# Altium project watch_V2.1.PrjPcb
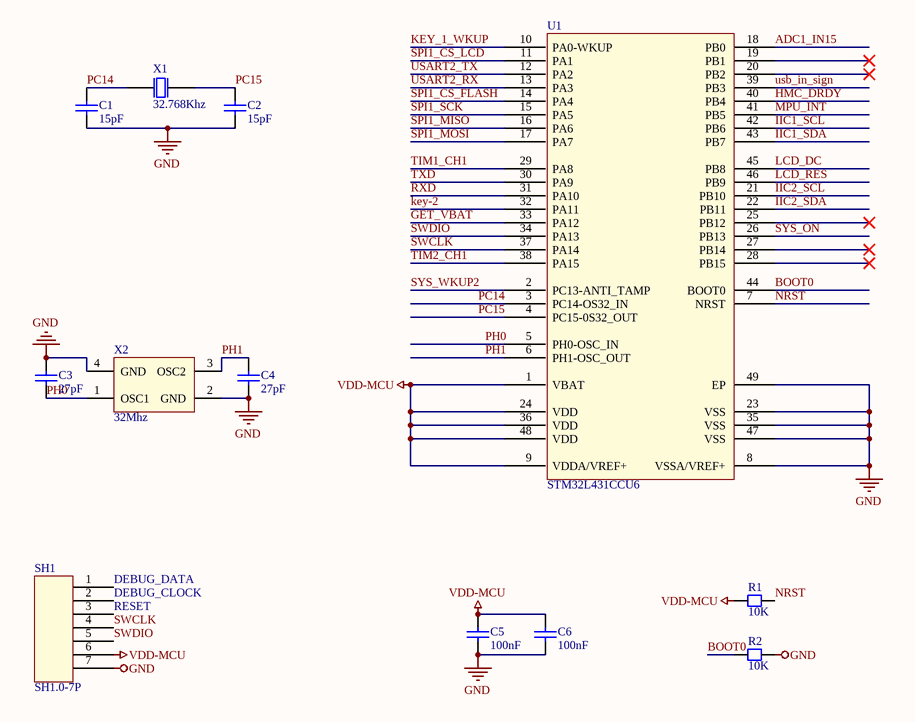
[diagram p0: 01-MCU-V2.1.SchDoc]
4 sheets, 97 parts. Net scope: global (net labels, ports and power ports of the same name join across sheets).
Board file: PCB-watch-V2.1.PcbDoc
Sheets:
  01-MCU-V2.1.SchDoc
  02-bluetooth-V2.1.SchDoc
  03-PeripheralPart-V2.1.SchDoc
  04-POWERV2.1.SchDoc

## Sheet 01-MCU-V2.1.SchDoc
size A4; Organization: Protel International P/L; Address1: L3, 12a Rodborough Rd; Address2: Frenchs Forest; Address3: NSW; Address4: Australia 2086

### Parts
C1  15pF  [CC1005-0402]
C2  15pF  [CC1005-0402]
C3  27pF  [CC1005-0402]
C4  27pF  [CC1005-0402]
C5  100nF  [CC1005-0402]
C6  100nF  [CC1005-0402]
R1  10K  [CR1005-0402]
R2  10K  [CR1005-0402]
SH1  SH1.0-7P  [SH1.0-6P]
U1  STM32L431CCU6  [STM32-UFQFPN48_N]
X1  32.768Khz  [XTAL-2012]
X2  32Mhz  [XTAL-2016]

### Nets
GND: C1.1 C2.1 C3.2 C4.1 C5.1 C6.1 R2.1 SH1.7 U1.8(VSSA/VREF+) U1.23(VSS) U1.35(VSS) U1.47(VSS) U1.49(EP) X2.2(GND) X2.4(GND)
VDD-MCU: C5.2 C6.2 R1.2 SH1.6 U1.1(VBAT) U1.9(VDDA/VREF+) U1.24(VDD) U1.36(VDD) U1.48(VDD)
ADC1_IN15: U1.18(PB0)
BOOT0: R2.2 U1.44(BOOT0)
DEBUG_CLOCK: SH1.2
DEBUG_DATA: SH1.1
GET_VBAT: U1.33(PA12)
HMC_DRDY: U1.40(PB4)
IIC1_SCL: U1.42(PB6)
IIC1_SDA: U1.43(PB7)
IIC2_SCL: U1.21(PB10)
IIC2_SDA: U1.22(PB11)
key-2: U1.32(PA11)
KEY_1_WKUP: U1.10(PA0-WKUP)
LCD_DC: U1.45(PB8)
LCD_RES: U1.46(PB9)
MPU_INT: U1.41(PB5)
NRST: R1.1 U1.7(NRST)
PC14: C1.2 U1.3(PC14-OS32_IN) X1.2
PC15: C2.2 U1.4(PC15-0S32_OUT) X1.1
PH0: C3.1 U1.5(PH0-OSC_IN) X2.1(OSC1)
PH1: C4.2 U1.6(PH1-OSC_OUT) X2.3(OSC2)
RESET: SH1.3
RXD: U1.31(PA10)
SPI1_CS_FLASH: U1.14(PA4)
SPI1_CS_LCD: U1.11(PA1)
SPI1_MISO: U1.16(PA6)
SPI1_MOSI: U1.17(PA7)
SPI1_SCK: U1.15(PA5)
SWCLK: SH1.4 U1.37(PA14)
SWDIO: SH1.5 U1.34(PA13)
SYS_ON: U1.26(PB13)
SYS_WKUP2: U1.2(PC13-ANTI_TAMP)
TIM1_CH1: U1.29(PA8)
TIM2_CH1: U1.38(PA15)
TXD: U1.30(PA9)
USART2_RX: U1.13(PA3)
USART2_TX: U1.12(PA2)
usb_in_sign: U1.39(PB3)

Not connected (* = marked no-connect by the designer): U1 19(PB1)* 20(PB2)* 25(PB12)* 27(PB14)* 28(PB15)*

### Notes on the sheet
- Title
- Size:
- Date:
- A4
- Number:
- Time:
- Revision:
- Sheet
- of
- File:

### Library data of the parts
C1-C6 = Chip capacitor: 贴片电容
R1 R2 = Chip resistor: 贴片电阻
SH1 = SH1.0-7P: 间距为1mm的端子
U1 = STM32L431CCU6: stm32低功耗单片机 主频80MHz
X1 = XTAL 2012: 2012封装的时钟晶振
X2 = XTAL 2016: 2016封装的晶振

## Sheet 02-bluetooth-V2.1.SchDoc
size A4; Organization: Protel International P/L; Address1: L3, 12a Rodborough Rd; Address2: Frenchs Forest; Address3: NSW; Address4: Australia 2086
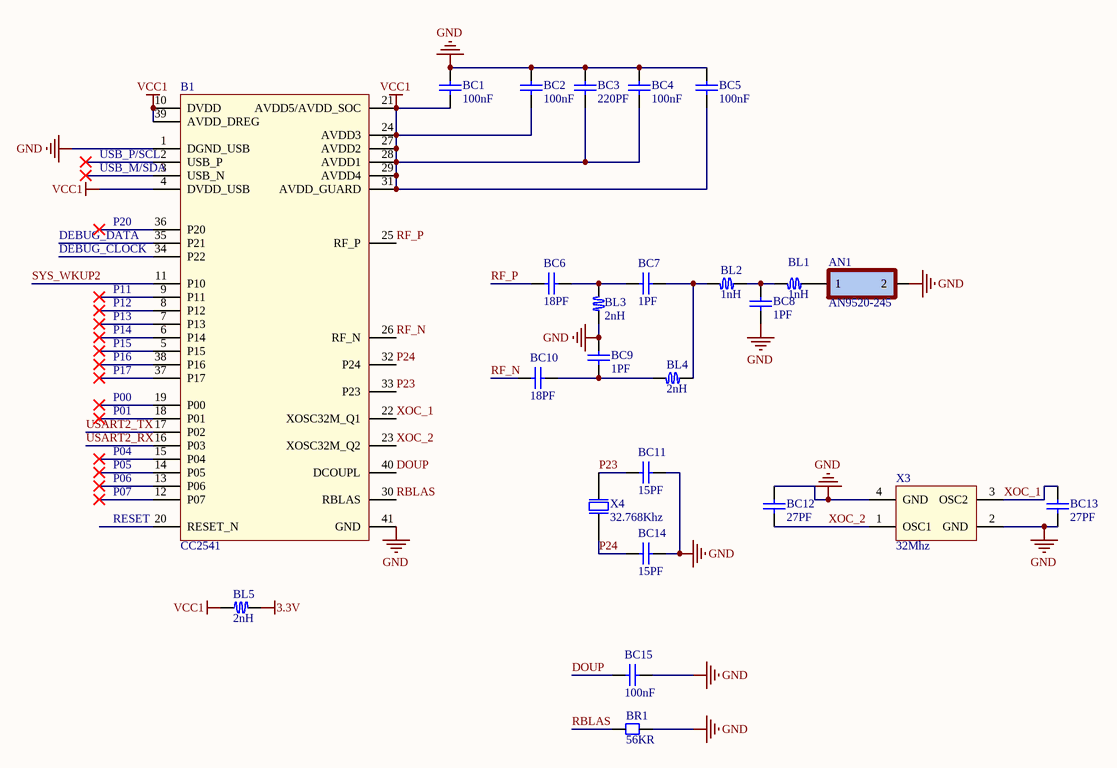
[diagram p1: 02-bluetooth-V2.1.SchDoc]

### Parts
AN1  AN9520-245  [AN-5120]
B1  CC2541  [QFN40-CC254X]
BC1  100nF  [CC1005-0402]
BC2  100nF  [CC1005-0402]
BC3  220PF  [CC1005-0402]
BC4  100nF  [CC1005-0402]
BC5  100nF  [CC1005-0402]
BC6  18PF  [CC1005-0402]
BC7  1PF  [CC1005-0402]
BC8  1PF  [CC1005-0402]
BC9  1PF  [CC1005-0402]
BC10  18PF  [CC1005-0402]
BC11  15PF  [CC1005-0402]
BC12  27PF  [CC1005-0402]
BC13  27PF  [CC1005-0402]
BC14  15PF  [CC1005-0402]
BC15  100nF  [CC1005-0402]
BL1  1nH  [Inductor-0402]
BL2  1nH  [Inductor-0402]
BL3  2nH  [Inductor-0402]
BL4  2nH  [Inductor-0402]
BL5  2nH  [Inductor-0402]
BR1  56KR  [CR1005-0402]
X3  32Mhz  [XTAL-2016]
X4  32.768Khz  [XTAL-2012]

### Nets
3.3V: BL5.2
GND: AN1.2 B1.1(DGND_USB) B1.41(GND) BC1.2 BC2.2 BC3.2 BC4.2 BC5.2 BC8.2 BC9.2 BC11.1 BC12.1 BC13.2 BC14.1 BC15.1 BL3.1 BR1.2 X3.2(GND) X3.4(GND)
VCC1: B1.4(DVDD_USB) B1.10(DVDD) B1.21(AVDD5/AVDD_SOC) B1.24(AVDD3) B1.27(AVDD2) B1.28(AVDD1) B1.29(AVDD4) B1.31(AVDD_GUARD) B1.39(AVDD_DREG) BC1.1 BC2.1 BC3.1 BC4.1 BC5.1 BL5.1
DEBUG_CLOCK: B1.34(P22)
DEBUG_DATA: B1.35(P21)
DOUP: B1.40(DCOUPL) BC15.2
P00: B1.19(P00)
P01: B1.18(P01)
P04: B1.15(P04)
P05: B1.14(P05)
P06: B1.13(P06)
P07: B1.12(P07)
P11: B1.9(P11)
P12: B1.8(P12)
P13: B1.7(P13)
P14: B1.6(P14)
P15: B1.5(P15)
P16: B1.38(P16)
P17: B1.37(P17)
P20: B1.36(P20)
P23: B1.33(P23) BC11.2 X4.2
P24: B1.32(P24) BC14.2 X4.1
RBLAS: B1.30(RBLAS) BR1.1
RESET: B1.20(RESET_N)
RF_N: B1.26(RF_N) BC10.2
RF_P: B1.25(RF_P) BC6.2
SYS_WKUP2: B1.11(P10)
USART2_RX: B1.16(P03)
USART2_TX: B1.17(P02)
USB_M/SDA: B1.3(USB_N)
USB_P/SCL: B1.2(USB_P)
XOC_1: B1.22(XOSC32M_Q1) BC13.1 X3.3(OSC2)
XOC_2: B1.23(XOSC32M_Q2) BC12.2 X3.1(OSC1)
NetAN1_1: AN1.1 BL1.1
NetBC6_1: BC6.1 BC7.2 BL3.2
NetBC7_1: BC7.1 BL2.2 BL4.1
NetBC8_1: BC8.1 BL1.2 BL2.1
NetBC9_1: BC9.1 BC10.1 BL4.2

### Notes on the sheet
- Title
- Size:
- Date:
- A4
- Number:
- Time:
- Revision:
- Sheet
- of
- File:

### Library data of the parts
AN1 = AN9520-245: 2.4G全向天线 蓝牙天线 陶瓷贴片 WIFI内置
B1 = CC2541: 低功耗蓝牙芯片
BC1-BC15 = Cap Chip 0402: 0402封装电容; Published: 8-Jun-2000; Revision: July-2002: Re-released for DXP Platform.; Publisher: Altium Limited
BL1-BL5 = Inductor-0402: 0402封装的电感
BR1 = Chip resistor: 贴片电阻
X3 = XTAL 2016: 2016封装的晶振
X4 = XTAL 2012: 2012封装的时钟晶振

## Sheet 03-PeripheralPart-V2.1.SchDoc
size A4
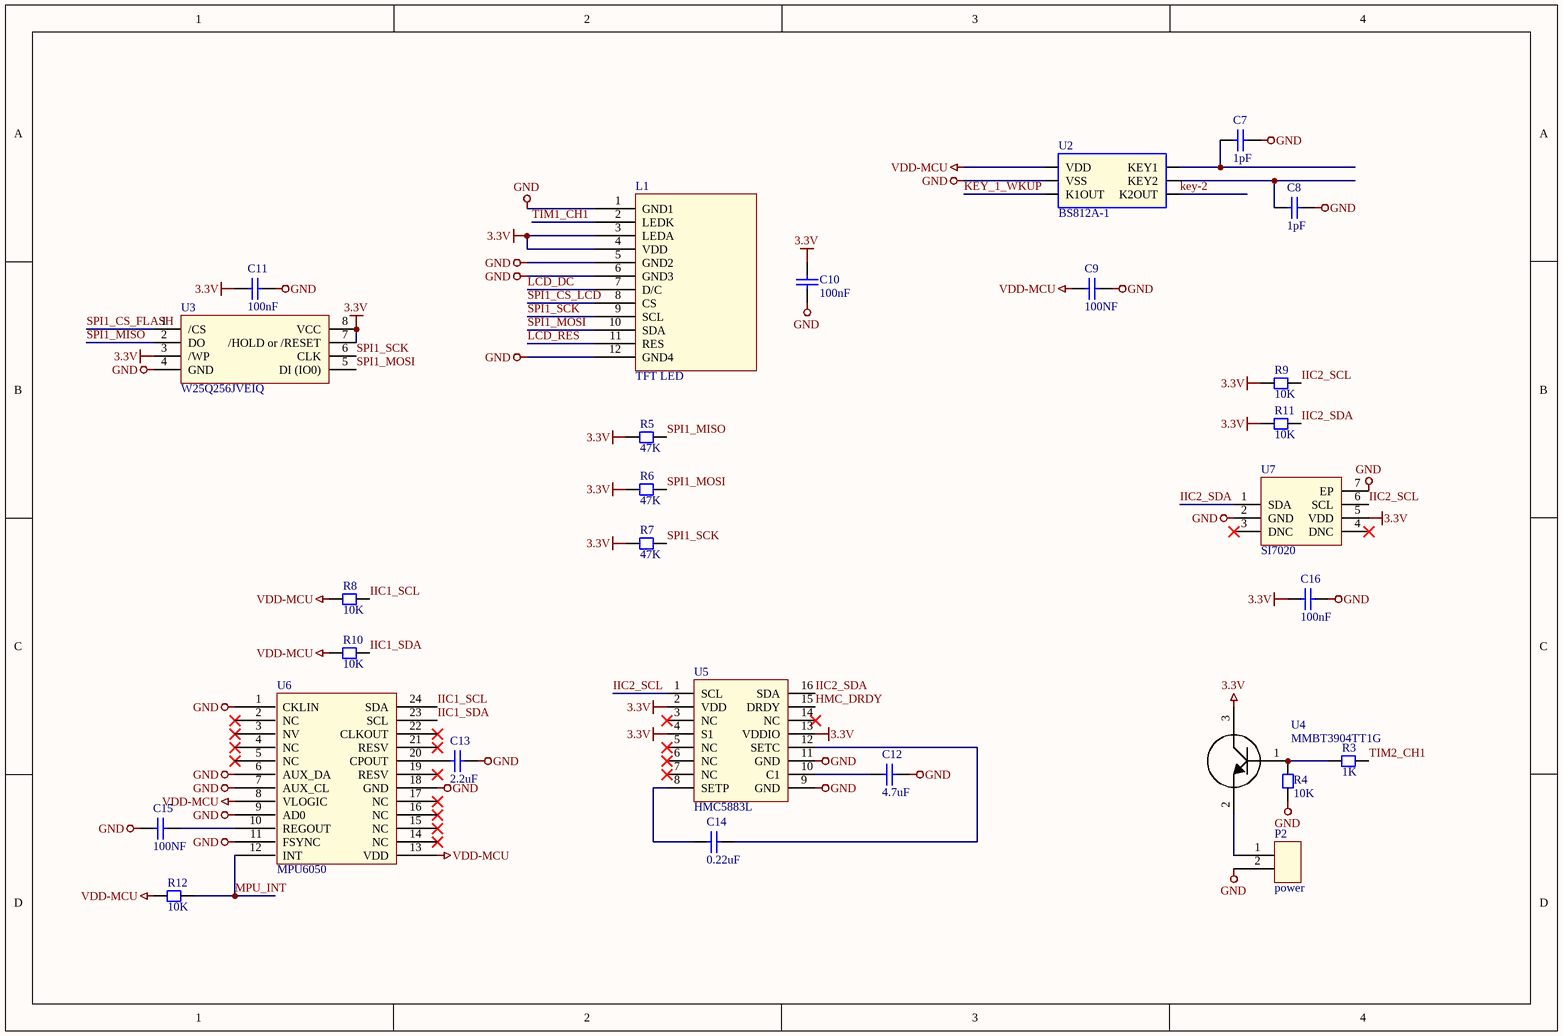
[diagram p2: 03-PeripheralPart-V2.1.SchDoc]

### Parts
C7  1pF  [CC1005-0402]
C8  1pF  [CC1005-0402]
C9  100NF  [CC1005-0402]
C10  100nF  [CC1005-0402]
C11  100nF  [CC1005-0402]
C12  4.7uF  [CC1005-0402]
C13  2.2uF  [CC1005-0402]
C14  0.22uF  [CC1005-0402]
C15  100NF  [CC1005-0402]
C16  100nF  [CC1005-0402]
L1  TFT LED  [LCD-1.3-(2)]
P2  power  [POWER-3.7V]
R3  1K  [CR1005-0402]
R4  10K  [CR1005-0402]
R5  47K  [CR1005-0402]
R6  47K  [CR1005-0402]
R7  47K  [CR1005-0402]
R8  10K  [CR1005-0402]
R9  10K  [CR1005-0402]
R10  10K  [CR1005-0402]
R11  10K  [CR1005-0402]
R12  10K  [CR1005-0402]
U2  BS812A-1  [SOT23-6]
U3  W25Q256JVEIQ  [WSON-8_L8.0-W6.10-P1.27-TL-EP]
U4  MMBT3904TT1G  [SOT-416]
U5  HMC5883L  [LPCC-16_L3.0-W3.0-P0.50-BL]
U6  MPU6050  [QFN24 - duplicate]
U7  SI7020  [DFN-6]

### Nets
3.3V: C10.1 C11.1 C16.1 L1.3(LEDA) L1.4(VDD) R5.2 R6.2 R7.2 R9.2 R11.2 U3.3(/WP) U3.7(/HOLD_or_/RESET) U3.8(VCC) U4.3 U5.2(VDD) U5.4(S1) U5.13(VDDIO) U7.5(VDD)
GND: C7.2 C8.2 C9.1 C10.2 C11.2 C12.2 C13.2 C15.1 C16.2 L1.1(GND1) L1.5(GND2) L1.6(GND3) L1.12(GND4) P2.2 R4.2 U2.2(VSS) U3.4(GND) U5.9(GND) U5.11(GND) U6.1(CKLIN) U6.6(AUX_DA) U6.7(AUX_CL) U6.9(AD0) U6.11(FSYNC) U6.18(GND) U7.2(GND) U7.7(EP)
VDD-MCU: C9.2 R8.2 R10.2 R12.2 U2.1(VDD) U6.8(VLOGIC) U6.13(VDD)
HMC_DRDY: U5.15(DRDY)
IIC1_SCL: R8.1 U6.24(SDA)
IIC1_SDA: R10.1 U6.23(SCL)
IIC2_SCL: R9.1 U5.1(SCL) U7.6(SCL)
IIC2_SDA: R11.1 U5.16(SDA) U7.1(SDA)
key-2: U2.4(K2OUT)
KEY_1_WKUP: U2.3(K1OUT)
LCD_DC: L1.7(D/C)
LCD_RES: L1.11(RES)
MPU_INT: R12.1 U6.12(INT)
SPI1_CS_FLASH: U3.1(/CS)
SPI1_CS_LCD: L1.8(CS)
SPI1_MISO: R5.1 U3.2(DO)
SPI1_MOSI: L1.10(SDA) R6.1 U3.5(DI_(IO0))
SPI1_SCK: L1.9(SCL) R7.1 U3.6(CLK)
TIM1_CH1: L1.2(LEDK)
TIM2_CH1: R3.1
NetC7_1: C7.1 U2.6(KEY1)
NetC8_1: C8.1 U2.5(KEY2)
NetC12_1: C12.1 U5.10(C1)
NetC13_1: C13.1 U6.20(CPOUT)
NetC14_1: C14.1 U5.8(SETP)
NetC14_2: C14.2 U5.12(SETC)
NetC15_2: C15.2 U6.10(REGOUT)
NetP2_1: P2.1 U4.2
NetR3_2: R3.2 R4.1 U4.1

Not connected (* = marked no-connect by the designer): U5 3(NC)* 5(NC)* 6(NC)* 7(NC)* 14(NC)*; U6 2(NC)* 3(NV)* 4(NC)* 5(NC)* 14(NC)* 15(NC)* 16(NC)* 17(NC)* 19(RESV)* 21(RESV)* 22(CLKOUT)*; U7 3(DNC)* 4(DNC)*

### Library data of the parts
C7-C16 = Chip capacitor: 贴片电容
L1 = LCD-IPSscreen-1.3: 1.3寸显示屏幕
R3-R12 = Chip resistor: 贴片电阻
U2 = BS812A-1: 触摸按键 两路 SOP23-6封装极简电路
U3 = W25Q256JVEIQ: FLASH
U4 = MMBT3904TT1G: NPN 电流 - 集电极（Ic）（最大值）：200mA 电压 - 集射极击穿（最大值）：40V SOT-23-3
U5 = HMC5883L: 三轴罗盘
U6 = MPU6050: 陀螺仪
U7 = SI7020: 温湿度传感器芯片

## Sheet 04-POWERV2.1.SchDoc
size A4
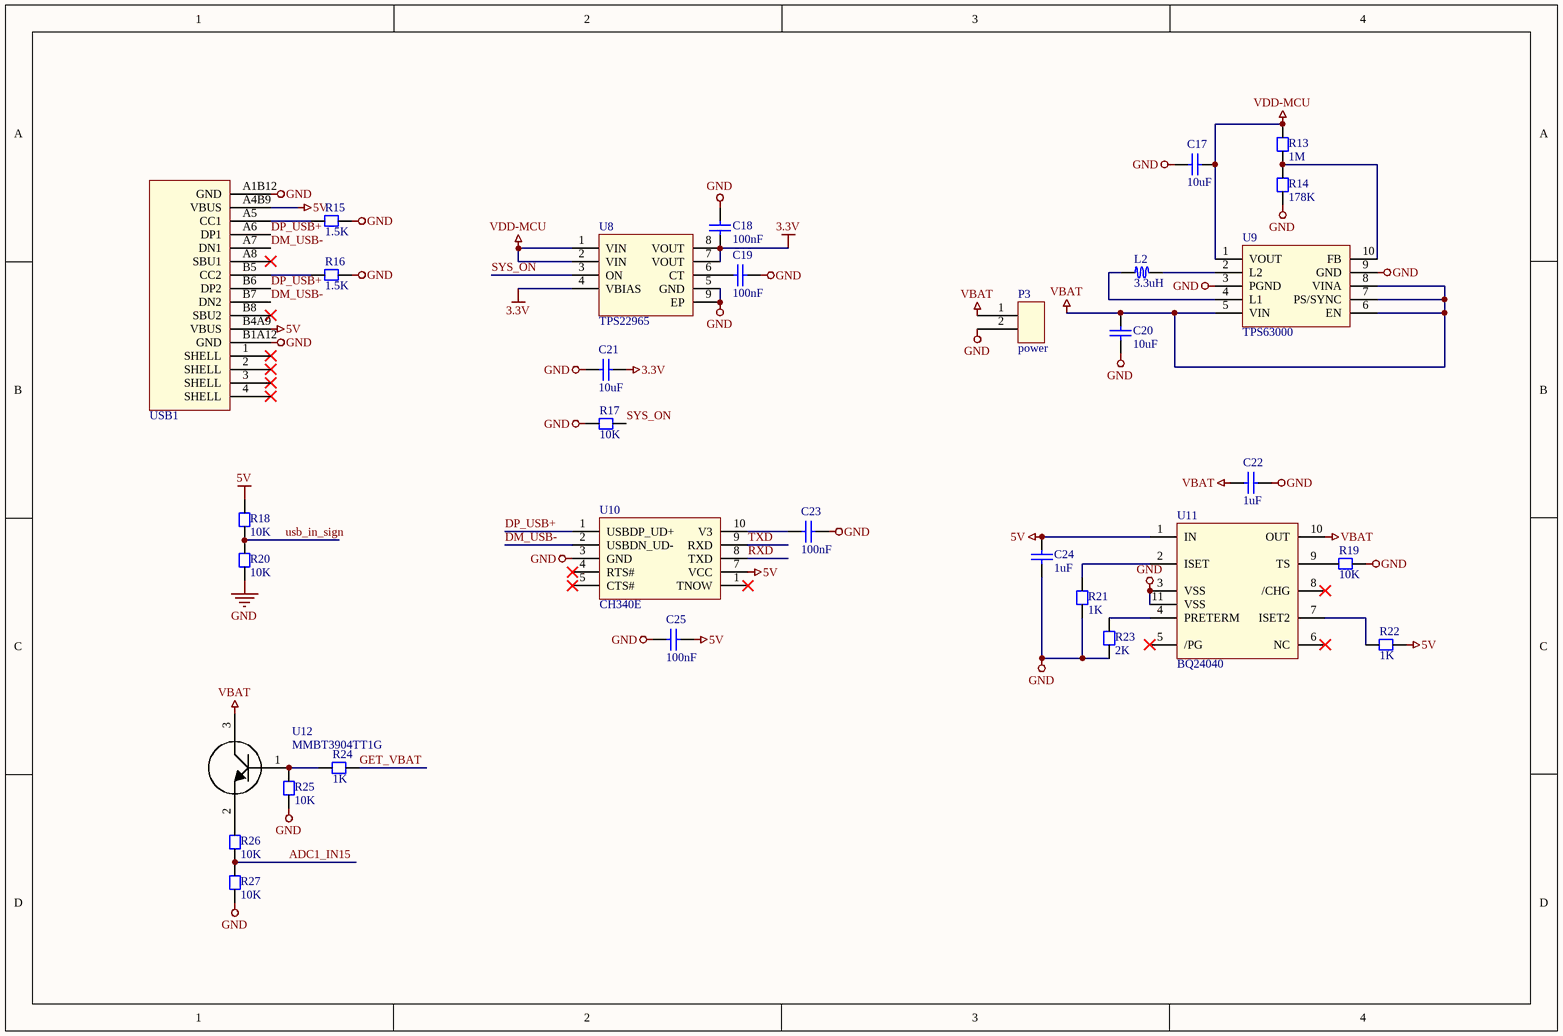
[diagram p3: 04-POWERV2.1.SchDoc]

### Parts
C17  10uF  [CC1005-0402]
C18  100nF  [CC1005-0402]
C19  100nF  [CC1005-0402]
C20  10uF  [CC1005-0402]
C21  10uF  [CC1005-0402]
C22  1uF  [CC1005-0402]
C23  100nF  [CC1005-0402]
C24  1uF  [CC1005-0402]
C25  100nF  [CC1005-0402]
L2  3.3uH  [Inductor-0805]
P3  power  [POWER-3.7V]
R13  1M  [CR1005-0402]
R14  178K  [CR1005-0402]
R15  1.5K  [CR1005-0402]
R16  1.5K  [CR1005-0402]
R17  10K  [CR1005-0402]
R18  10K  [CR1005-0402]
R19  10K  [CR1005-0402]
R20  10K  [CR1005-0402]
R21  1K  [CR1005-0402]
R22  1K  [CR1005-0402]
R23  2K  [CR1005-0402]
R24  1K  [CR1005-0402]
R25  10K  [CR1005-0402]
R26  10K  [CR1005-0402]
R27  10K  [CR1005-0402]
U8  TPS22965  [UDFN-8]
U9  TPS63000  [SON10]
U10  CH340E  [MSOP-10]
U11  BQ24040  [WSON-10_L2.0-W2.0-P0.40-BL-EP]
U12  MMBT3904TT1G  [SOT-416]
USB1  Tpye-c 16P  [TYPE-C 16P]  (value not drawn)

### Nets
3.3V: C18.1 C21.2 U8.4(VBIAS) U8.7(VOUT) U8.8(VOUT)
5V: C24.1 C25.2 R18.1 R22.2 U10.7(VCC) U11.1(IN) USB1.A4B9(VBUS) USB1.B4A9(VBUS)
GND: C17.1 C18.2 C19.1 C20.1 C21.1 C22.1 C23.2 C24.2 C25.1 P3.2 R14.1 R15.1 R16.1 R17.2 R19.2 R20.2 R21.2 R23.2 R25.2 R27.2 U8.5(GND) U8.9(EP) U9.3(PGND) U9.9(GND) U10.3(GND) U11.3(VSS) U11.11(VSS) USB1.A1B12(GND) USB1.B1A12(GND)
VBAT: C20.2 C22.2 P3.1 U9.5(VIN) U9.6(EN) U9.7(PS/SYNC) U9.8(VINA) U11.10(OUT) U12.3
VDD-MCU: C17.2 R13.1 U8.1(VIN) U8.2(VIN) U9.1(VOUT)
ADC1_IN15: R26.2 R27.1
DM_USB-: U10.2(USBDN_UD-) USB1.A7(DN1) USB1.B7(DN2)
DP_USB+: U10.1(USBDP_UD+) USB1.A6(DP1) USB1.B6(DP2)
GET_VBAT: R24.2
RXD: U10.8(TXD)
SYS_ON: R17.1 U8.3(ON)
TXD: U10.9(RXD)
usb_in_sign: R18.2 R20.1
NetC19_2: C19.2 U8.6(CT)
NetC23_1: C23.1 U10.10(V3)
NetL2_1: L2.1 U9.4(L1)
NetL2_2: L2.2 U9.2(L2)
NetR13_2: R13.2 R14.2 U9.10(FB)
NetR15_2: R15.2 USB1.A5(CC1)
NetR16_2: R16.2 USB1.B5(CC2)
NetR19_1: R19.1 U11.9(TS)
NetR21_1: R21.1 U11.2(ISET)
NetR22_1: R22.1 U11.7(ISET2)
NetR23_1: R23.1 U11.4(PRETERM)
NetR24_1: R24.1 R25.1 U12.1
NetR26_1: R26.1 U12.2

Not connected (* = marked no-connect by the designer): U10 4(RTS#)* 5(CTS#)*; U11 5(/PG)* 6(NC)* 8(/CHG)*; USB1 1(SHELL)* 2(SHELL)* 3(SHELL)* 4(SHELL)* A8(SBU1)* B8(SBU2)*

### Library data of the parts
C17-C25 = Chip capacitor: 贴片电容
L2 = Chip inductor: 贴片电感
R13-R27 = Chip resistor: 贴片电阻
U8 = TPS22965: DFN-8 功率开关芯片 TPS22965DSGR
U9 = TPS63000: 宽电压电源转换芯片输出3.3V输入1V至6V
U10 = CH340E: usd转串口芯片 MSOP10封装
U11 = BQ24041: 1A 具有自动启动功能的单输入，单节锂离子和锂聚合物电池充电 / 器 /
U12 = MMBT3904TT1G: as U4 on sheet 03-PeripheralPart-V2.1
USB1 = Tpye-c 16P: 16P 封装的TYPE -c接口 4固定插脚 双向

## Nets that join several sheets
3.3V: 02-bluetooth-V2.1 (BL5.2), 03-PeripheralPart-V2.1 (18 pins), 04-POWERV2.1 (5 pins)
GND: 01-MCU-V2.1 (15 pins), 02-bluetooth-V2.1 (19 pins), 03-PeripheralPart-V2.1 (27 pins), 04-POWERV2.1 (29 pins)
VDD-MCU: 01-MCU-V2.1 (9 pins), 03-PeripheralPart-V2.1 (7 pins), 04-POWERV2.1 (5 pins)
ADC1_IN15: 01-MCU-V2.1 (U1.18), 04-POWERV2.1 (R26.2 R27.1)
DEBUG_CLOCK: 01-MCU-V2.1 (SH1.2), 02-bluetooth-V2.1 (B1.34)
DEBUG_DATA: 01-MCU-V2.1 (SH1.1), 02-bluetooth-V2.1 (B1.35)
GET_VBAT: 01-MCU-V2.1 (U1.33), 04-POWERV2.1 (R24.2)
HMC_DRDY: 01-MCU-V2.1 (U1.40), 03-PeripheralPart-V2.1 (U5.15)
IIC1_SCL: 01-MCU-V2.1 (U1.42), 03-PeripheralPart-V2.1 (R8.1 U6.24)
IIC1_SDA: 01-MCU-V2.1 (U1.43), 03-PeripheralPart-V2.1 (R10.1 U6.23)
IIC2_SCL: 01-MCU-V2.1 (U1.21), 03-PeripheralPart-V2.1 (R9.1 U5.1 U7.6)
IIC2_SDA: 01-MCU-V2.1 (U1.22), 03-PeripheralPart-V2.1 (R11.1 U5.16 U7.1)
key-2: 01-MCU-V2.1 (U1.32), 03-PeripheralPart-V2.1 (U2.4)
KEY_1_WKUP: 01-MCU-V2.1 (U1.10), 03-PeripheralPart-V2.1 (U2.3)
LCD_DC: 01-MCU-V2.1 (U1.45), 03-PeripheralPart-V2.1 (L1.7)
LCD_RES: 01-MCU-V2.1 (U1.46), 03-PeripheralPart-V2.1 (L1.11)
MPU_INT: 01-MCU-V2.1 (U1.41), 03-PeripheralPart-V2.1 (R12.1 U6.12)
RESET: 01-MCU-V2.1 (SH1.3), 02-bluetooth-V2.1 (B1.20)
RXD: 01-MCU-V2.1 (U1.31), 04-POWERV2.1 (U10.8)
SPI1_CS_FLASH: 01-MCU-V2.1 (U1.14), 03-PeripheralPart-V2.1 (U3.1)
SPI1_CS_LCD: 01-MCU-V2.1 (U1.11), 03-PeripheralPart-V2.1 (L1.8)
SPI1_MISO: 01-MCU-V2.1 (U1.16), 03-PeripheralPart-V2.1 (R5.1 U3.2)
SPI1_MOSI: 01-MCU-V2.1 (U1.17), 03-PeripheralPart-V2.1 (L1.10 R6.1 U3.5)
SPI1_SCK: 01-MCU-V2.1 (U1.15), 03-PeripheralPart-V2.1 (L1.9 R7.1 U3.6)
SYS_ON: 01-MCU-V2.1 (U1.26), 04-POWERV2.1 (R17.1 U8.3)
SYS_WKUP2: 01-MCU-V2.1 (U1.2), 02-bluetooth-V2.1 (B1.11)
TIM1_CH1: 01-MCU-V2.1 (U1.29), 03-PeripheralPart-V2.1 (L1.2)
TIM2_CH1: 01-MCU-V2.1 (U1.38), 03-PeripheralPart-V2.1 (R3.1)
TXD: 01-MCU-V2.1 (U1.30), 04-POWERV2.1 (U10.9)
USART2_RX: 01-MCU-V2.1 (U1.13), 02-bluetooth-V2.1 (B1.16)
USART2_TX: 01-MCU-V2.1 (U1.12), 02-bluetooth-V2.1 (B1.17)
usb_in_sign: 01-MCU-V2.1 (U1.39), 04-POWERV2.1 (R18.2 R20.1)